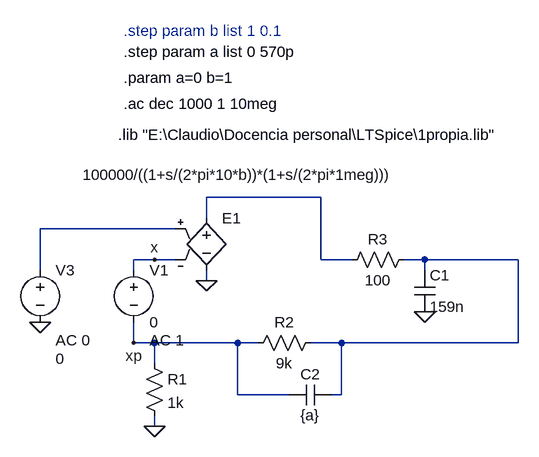
[diagram p0: schematic parcial 2024 est3.asc]
parcial 2024 est3.asc, the LTspice schematic file:
Version 4
SHEET 1 1184 680
WIRE 448 -48 272 -48
WIRE 272 -16 272 -48
WIRE 224 0 16 0
WIRE 192 48 160 48
WIRE 224 48 192 48
WIRE 448 48 448 -48
WIRE 496 48 448 48
WIRE 608 48 576 48
WIRE 752 48 608 48
WIRE 16 64 16 0
WIRE 160 64 160 48
WIRE 608 64 608 48
WIRE 272 80 272 64
WIRE 160 176 160 144
WIRE 192 176 160 176
WIRE 320 176 192 176
WIRE 352 176 320 176
WIRE 480 176 432 176
WIRE 752 176 752 48
WIRE 752 176 480 176
WIRE 192 208 192 176
WIRE 320 256 320 176
WIRE 400 256 320 256
WIRE 480 256 480 176
WIRE 480 256 464 256
WIRE 192 304 192 288
FLAG 16 144 0
FLAG 192 304 0
FLAG 608 128 0
FLAG 272 80 0
FLAG 192 48 x
FLAG 160 176 xp
SYMBOL voltage 16 48 R0
WINDOW 123 24 124 Left 2
WINDOW 39 0 0 Left 0
WINDOW 3 24 152 Left 2
SYMATTR Value2 AC 0
SYMATTR Value 0
SYMATTR InstName V3
SYMBOL res 176 192 R0
SYMATTR InstName R1
SYMATTR Value 1k
SYMBOL res 448 160 R90
WINDOW 0 0 56 VBottom 2
WINDOW 3 32 56 VTop 2
SYMATTR InstName R2
SYMATTR Value 9k
SYMBOL res 592 32 R90
WINDOW 0 0 56 VBottom 2
WINDOW 3 32 56 VTop 2
SYMATTR InstName R3
SYMATTR Value 100
SYMBOL cap 592 64 R0
SYMATTR InstName C1
SYMATTR Value 159n
SYMBOL e 272 -32 R0
WINDOW 3 -191 -51 Left 2
SYMATTR Value 100000/((1+s/(2*pi*10*b))*(1+s/(2*pi*1meg)))
SYMATTR InstName E1
SYMATTR SpiceModel laplace
SYMBOL voltage 160 48 R0
WINDOW 123 24 124 Left 2
WINDOW 39 0 0 Left 0
SYMATTR Value2 AC 1
SYMATTR InstName V1
SYMATTR Value 0
SYMBOL cap 464 240 R90
WINDOW 0 0 32 VBottom 2
WINDOW 3 32 32 VTop 2
SYMATTR InstName C2
SYMATTR Value {a}
TEXT 136 -144 Left 2 !.lib "E:\\Claudio\\Docencia personal\\LTSpice\\1propia.lib"
TEXT 144 -192 Left 2 !.ac dec 1000 1 10meg
TEXT 144 -232 Left 2 !.param a=0 b=1
TEXT 144 -272 Left 2 !.step param a list 0 570p
TEXT 144 -304 Left 2 ;.step param b list 1 0.1

The netlist it stands for:
* parcial 2024 est3.asc
V3 N002 0 0 AC 0
R1 xp 0 1k
R2 N003 xp 9k
R3 N003 N001 100
C1 N003 0 159n
E1 N001 0 N002 x laplace 100000/((1+s/(2*pi*10*b))*(1+s/(2*pi*1meg)))
V1 x xp 0 AC 1
C2 N003 xp {a}
.lib "E:\Claudio\Docencia personal\LTSpice\1propia.lib"
.ac dec 1000 1 10meg
.param a=0 b=1
.step param a list 0 570p
* .step param b list 1 0.1
.backanno
.end